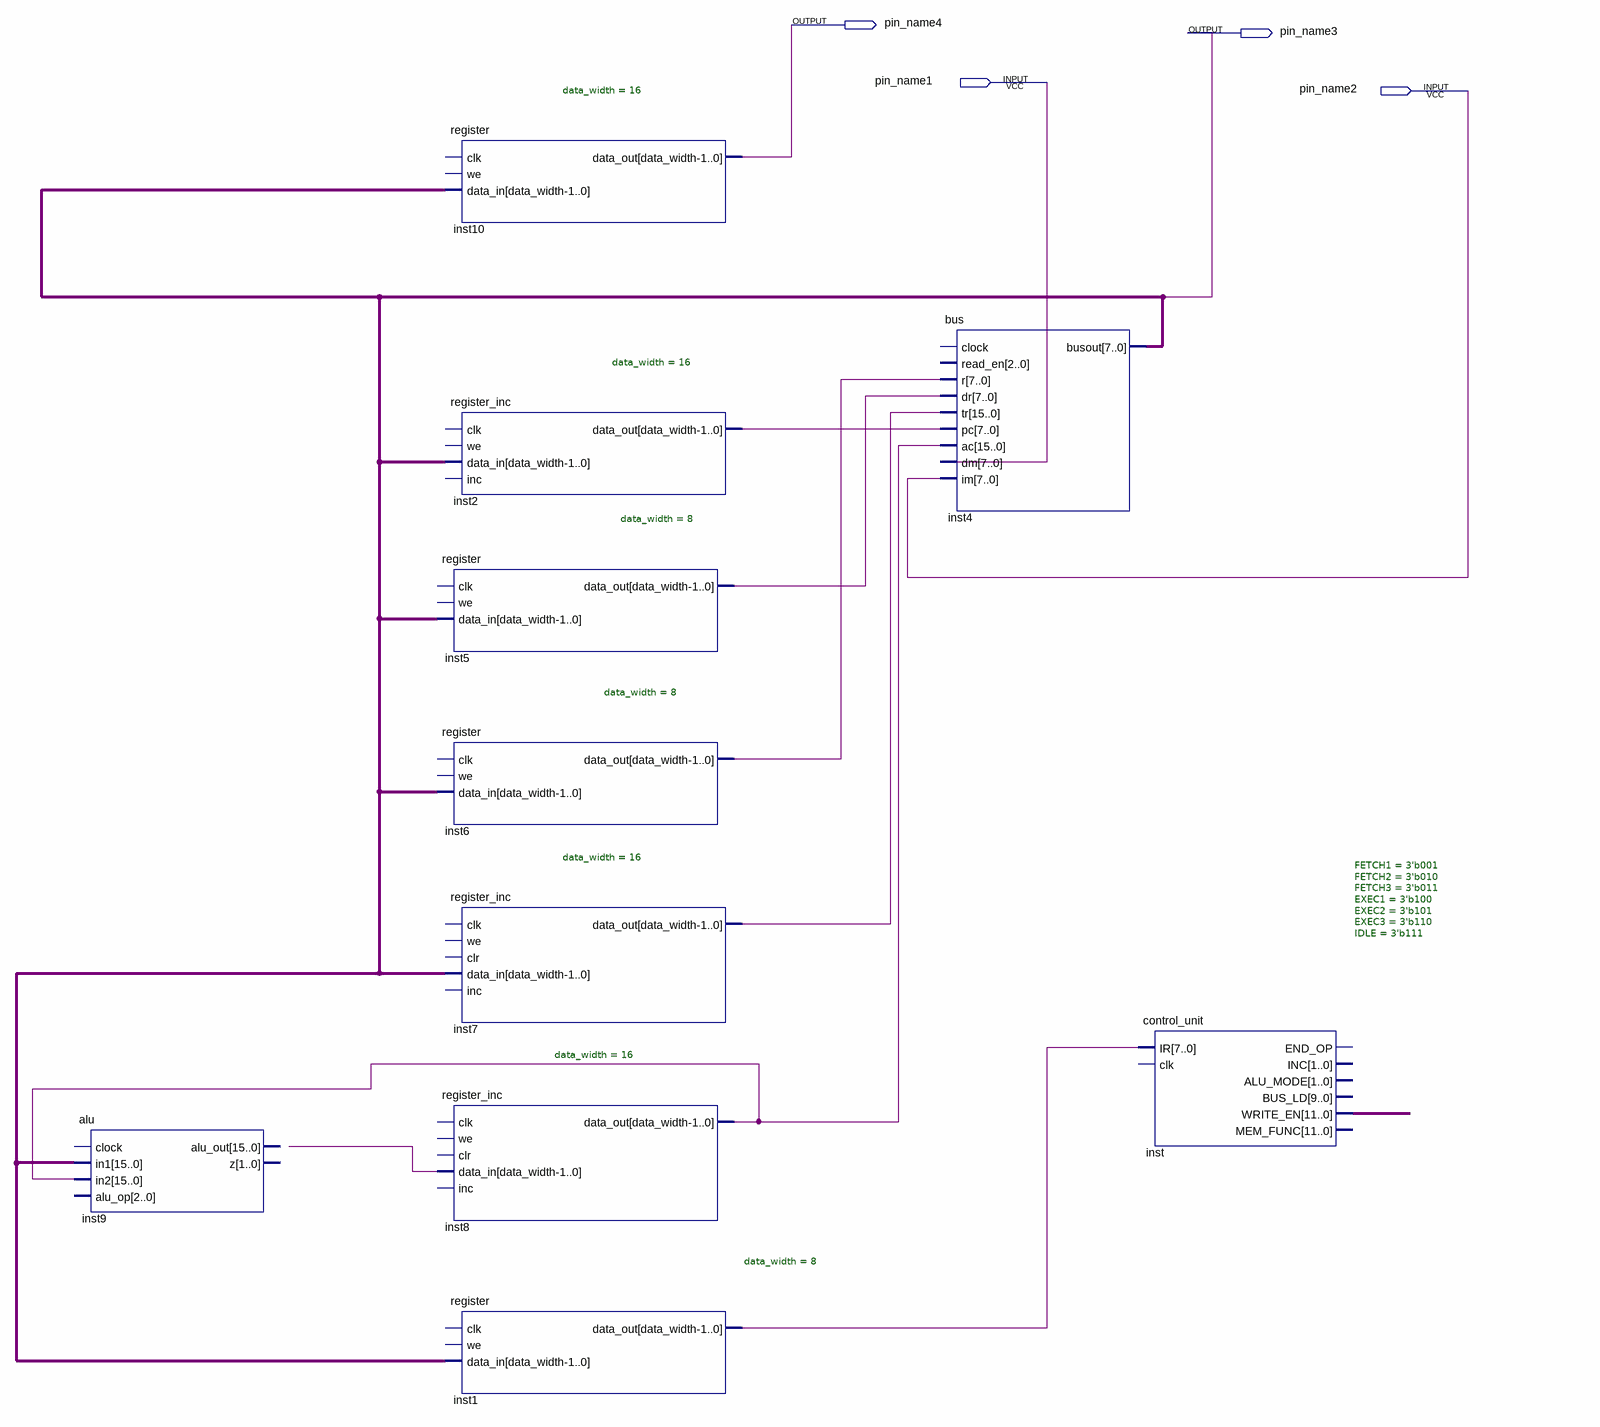
[diagram p0: schematic sheet]
// Quartus schematic processor_1_top.bdf as structural Verilog: 10 symbols, 4 pins
module processor_1_top (
  input  pin_name1,
  input  pin_name2,
  output pin_name4,
  output pin_name3
);

  wire inst1_data_out, inst2_data_out, inst5_data_out, inst6_data_out, inst7_data_out, inst8_data_out,
       undriven;
  wire [11:0] inst_write_en;
  wire [15:0] inst4_busout;

  alu inst9 (.in1(inst4_busout), .in2({16{inst8_data_out}}));  // open: clock, alu_op, alu_out, z
  register #(.data_width(16)) inst10 (.data_in(inst4_busout), .data_out(pin_name4));  // open: clk, we
  register_inc #(.data_width(16)) inst2 (.data_in(inst4_busout), .data_out(inst2_data_out));  // open: clk, we, inc
  register #(.data_width(8)) inst5 (.data_in(inst4_busout), .data_out(inst5_data_out));  // open: clk, we
  register #(.data_width(8)) inst6 (.data_in(inst4_busout), .data_out(inst6_data_out));  // open: clk, we
  register_inc #(.data_width(16)) inst7 (.data_in(inst4_busout), .data_out(inst7_data_out));  // open: clk, we, clr, inc
  register_inc #(.data_width(16)) inst8 (
    .data_in({16{undriven}}), .data_out(inst8_data_out));  // open: clk, we, clr, inc
  register #(.data_width(8)) inst1 (.data_in(inst4_busout), .data_out(inst1_data_out));  // open: clk, we
  bus inst4 (
    .r({8{inst6_data_out}}), .dr({8{inst5_data_out}}), .tr({16{inst7_data_out}}), .pc({8{inst2_data_out}}),
    .ac({16{inst8_data_out}}), .dm({8{pin_name1}}), .im({8{pin_name2}}), .busout(inst4_busout));  // open: clock, read_en
  control_unit #(.FETCH1(3'b001), .FETCH2(3'b010), .FETCH3(3'b011), .EXEC1(3'b100), .EXEC2(3'b101), .EXEC3(3'b110), .IDLE(3'b111)) inst (
    .IR({8{inst1_data_out}}), .WRITE_EN(inst_write_en));  // open: clk, END_OP, INC, ALU_MODE, BUS_LD, MEM_FUNC
endmodule
